# EAGLE design nano_shield (EAGLE 8.2.2)
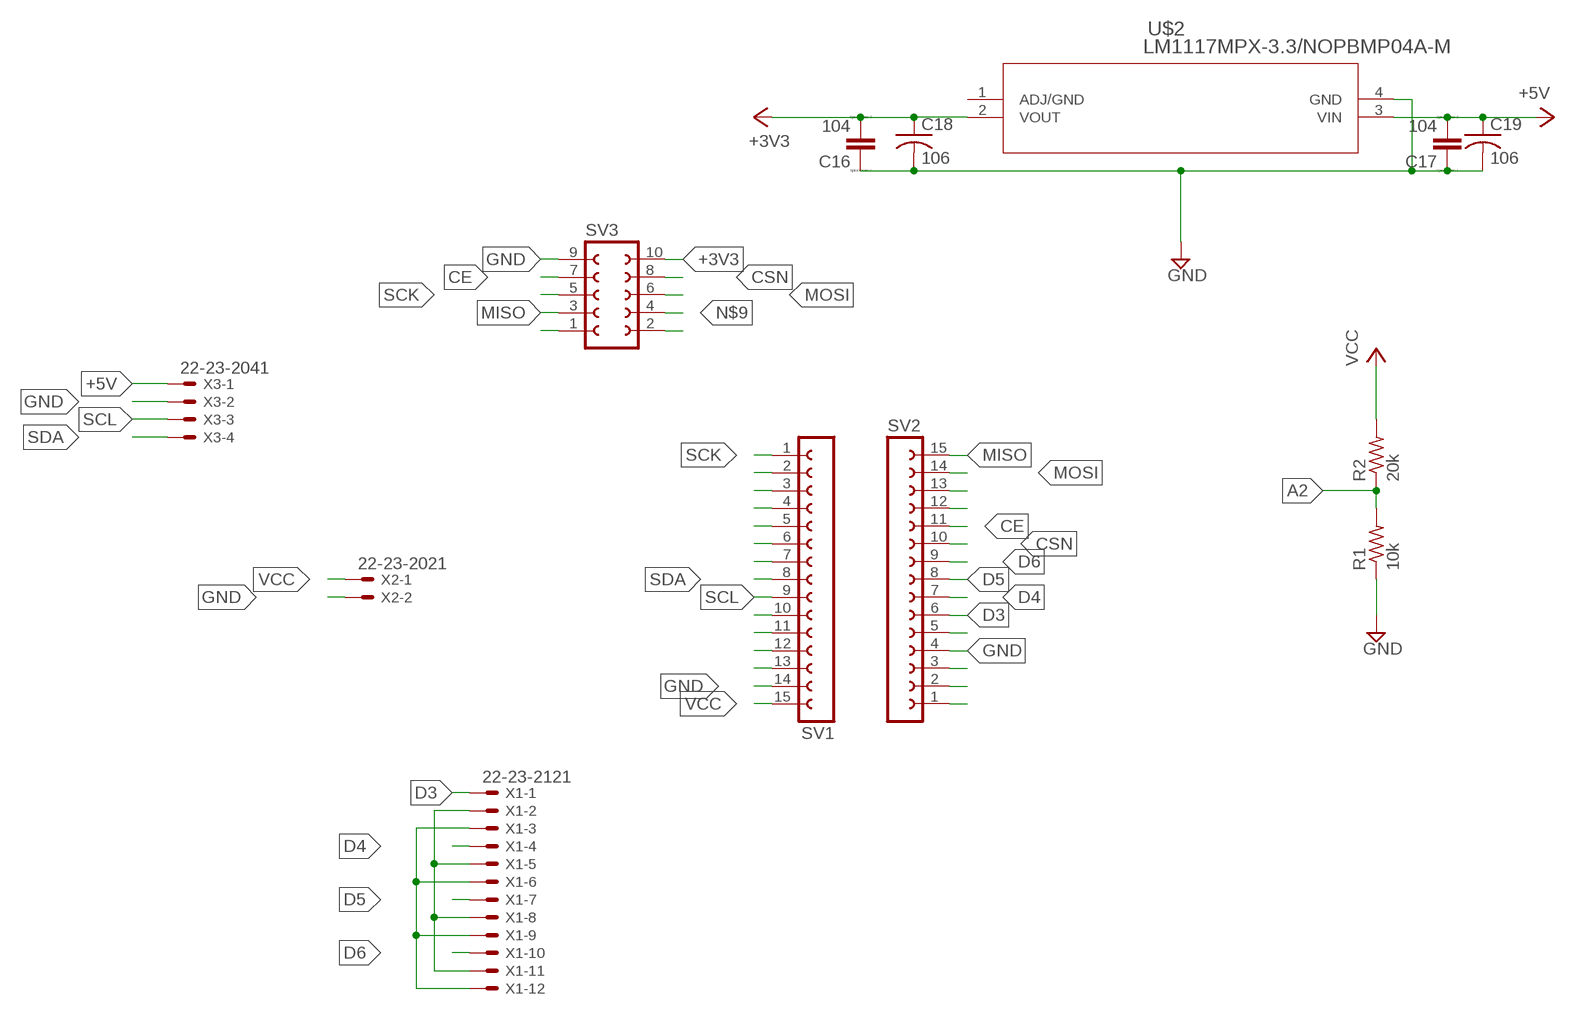
[diagram p0: schematic, sheet 1]

## Parts
C16  104  CC0603  [C0603]
C17  104  CC0603  [C0603]
C18  106  C-USC0805  [C0805]
C19  106  C-USC0805  [C0805]
R1  10k  R-US_R0603  [R0603]
R2  20k  R-US_R0603  [R0603]
SV1  FE15-1  [FE15]
SV2  FE15-1  [FE15]
SV3  FE05-2  [FE05-2]
U$2  LM1117MPX-3.3/NOPBMP04A-M  [MP04A-M]
X1  22-23-2121  [22-23-2121]
X2  22-23-2021  [22-23-2021]
X3  22-23-2041  [22-23-2041]

## Nets
+3V3: C16.2 C18.1 SV3.10 U$2.2(VOUT)
+5V: C17.2 C19.1 U$2.3(VIN) X1.2 X1.5 X1.8 X1.11 X3.1
A2: R1.2 R2.1 SV1.6
CE: SV2.11 SV3.7
CSN: SV2.10 SV3.8
D3: SV2.6 X1.1
D4: SV2.7 X1.4
D5: SV2.8 X1.7
D6: SV2.9 X1.10
GND: C16.1 C17.1 C18.2 C19.2 R1.1 SV1.14 SV2.4 SV3.9 U$2.4(GND) X1.3 X1.6 X1.9 X1.12 X2.2 X3.2
MISO: SV2.15 SV3.3
MOSI: SV2.14 SV3.6
N$5: SV3.1
N$6: SV1.2
N$9: SV3.4
N$10: SV3.2
N$11: SV1.3
N$12: SV1.4
N$13: SV1.5
N$15: SV1.7
N$18: SV1.10
N$19: SV1.11
N$20: SV1.12
N$21: SV1.13
N$26: SV2.13
N$27: SV2.12
N$34: SV2.5
N$36: SV2.3
N$37: SV2.2
N$38: SV2.1
SCK: SV1.1 SV3.5
SCL: SV1.9 X3.3
SDA: SV1.8 X3.4
VCC: R2.2 SV1.15 X2.1
Unconnected: U$2.1(ADJ/GND)

## Library data of the parts
C16 C17 = eagle-ltspice:C: CAPACITOR, European symbol; SPICEMODEL: NONE; SPICEPREFIX: C
C18 C19 = rcl:C-US: CAPACITOR, American symbol
R1 R2 = rcl:R-US_: RESISTOR, American symbol
SV1 SV2 = con-lsta:FE15-1: FEMALE HEADER; OC_FARNELL: unknown; OC_NEWARK: unknown
SV3 = con-lsta:FE05-2: FEMALE HEADER; OC_FARNELL: unknown; OC_NEWARK: unknown
U$2 = lm1117:LM1117MPX-3.3/NOPB; MANUFACTURER_PART_NUMBER: LM1117MPX3.3NOPB; VENDOR: National Semiconductor
X1 = con-molex:22-23-2121: .100" (2.54mm) Center Header - 12 Pin; MF: MOLEX; MPN: 22-23-2121; OC_FARNELL: 1462935; OC_NEWARK: 56H0456
X2 = con-molex:22-23-2021: .100" (2.54mm) Center Header - 2 Pin; MF: MOLEX; MPN: 22-23-2021; OC_FARNELL: 1462926; OC_NEWARK: 25C3832
X3 = con-molex:22-23-2041: .100" (2.54mm) Center Header - 4 Pin; MF: MOLEX; MPN: 22-23-2041; OC_FARNELL: 1462920; OC_NEWARK: 38C0355

## Net classes
0 default: width 0.305 mm, drill 0.508 mm, clearance 0.254 mm

## Board
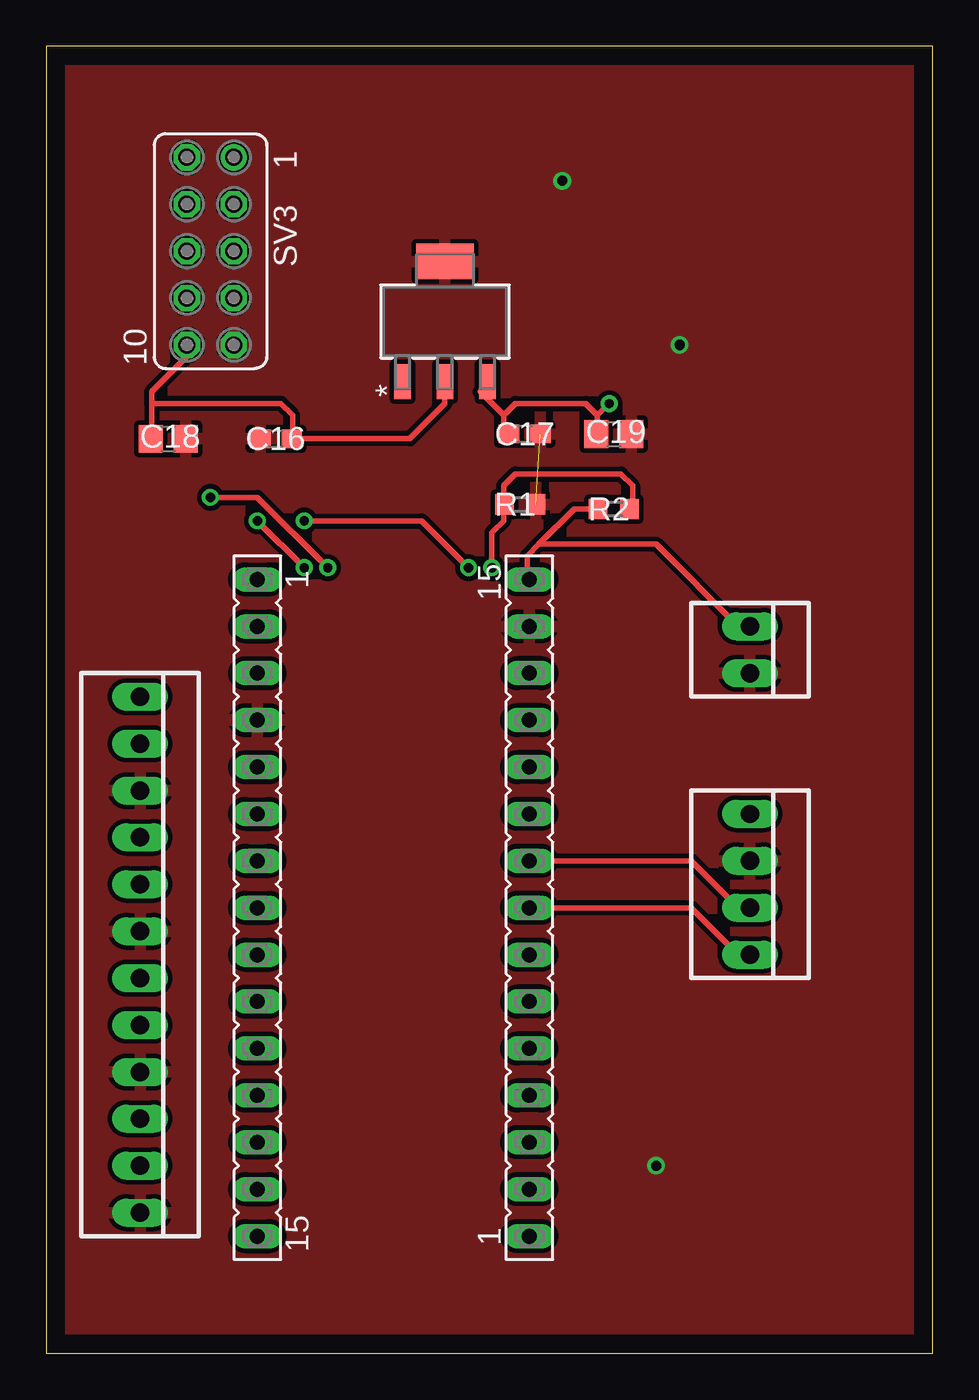
[diagram p1: board, top side]
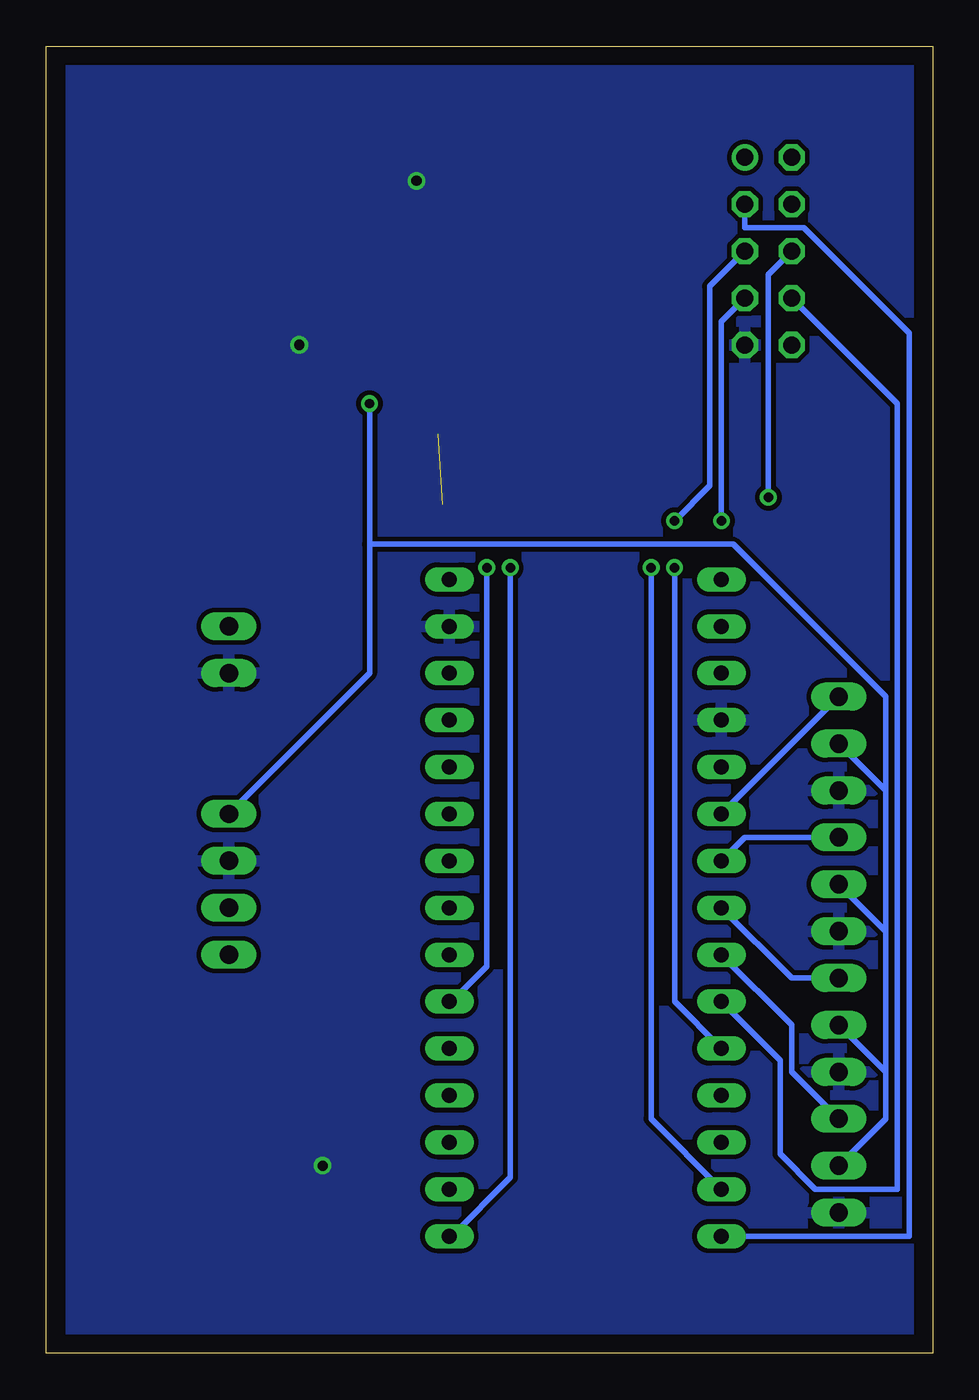
[diagram p2: board, bottom side, seen from below]

Size 47.99 x 70.79 mm. Coordinates in mm from the lower left corner, seen from the top.
Outline: 0,0 47.99,0 47.99,70.79 0,70.79 0,0
Copper layers (1*16): Top 0.035mm / dielectric 1.5mm / Bottom 0.035mm
Design rules "default": minimum track width 6mil, minimum drill 0.35mm, track to track 6mil, track to pad 6mil, pad to pad 6mil, via to via 6mil, smd to smd 6mil, copper to edge 40mil, drill to drill 6mil, minimum pad ring 10mil, minimum via ring 8mil, stop-mask expansion 4mil, vias tented up to drill 0mil, thermal gap 10mil

### Footprints (pad centres in the part's own frame; a part is rotated, then mirrored left to right if it is on the bottom)
C0603 = smd 1.1 x 1: 1 -0.85,0; 2 0.85,0
C0805 = smd 1.3 x 1.5: 1 -0.95,0; 2 0.95,0
R0603 = smd 1 x 1.1: 1 -0.85,0; 2 0.85,0
FE15 = drill 0.813 long: 1 -17.78,0; 2 -15.24,0; 3 -12.7,0; 4 -10.16,0; 5 -7.62,0; 6 -5.08,0; 7 -2.54,0; 8 0,0; 9 2.54,0; 10 5.08,0; 11 7.62,0; 12 10.16,0; 13 12.7,0; 14 15.24,0; 15 17.78,0
FE05-2 = drill 0.914: 1 -5.08,1.27 | drill 0.914 octagon: 2 -5.08,-1.27; 3 -2.54,1.27; 4 -2.54,-1.27; 5 0,1.27; 6 0,-1.27; 7 2.54,1.27; 8 2.54,-1.27; 9 5.08,1.27; 10 5.08,-1.27
MP04A-M = smd 1.905 x 0.889: 1 -3.251,2.3; 2 -3.251,0; 3 -3.251,-2.3 | smd 1.905 x 3.099: 4 3.251,0
22-23-2121 = drill 1 long: 1 -13.97,0; 2 -11.43,0; 3 -8.89,0; 4 -6.35,0; 5 -3.81,0; 6 -1.27,0; 7 1.27,0; 8 3.81,0; 9 6.35,0; 10 8.89,0; 11 11.43,0; 12 13.97,0
22-23-2021 = drill 1 long: 1 -1.27,0; 2 1.27,0
22-23-2041 = drill 1 long: 1 -3.81,0; 2 -1.27,0; 3 1.27,0; 4 3.81,0

### Placement (x,y rotation side)
C16  12.45,49.53 0 top
C17  25.91,49.78 180 top
C18  6.6,49.53 0 top
C19  30.73,49.78 0 top
R1  25.65,45.97 180 top
R2  30.73,45.72 180 top
SV1  26.16,24.13 90 top
SV2  11.43,24.13 270 top
SV3  8.89,59.69 270 top
U$2  21.59,55.88 90 top
X1  5.08,21.59 270 top
X2  38.1,38.1 270 top
X3  38.1,25.4 270 top

### Tracks (layer width: path | path; a pad name or v marks a point on that pad's centre or on a via)
+3V3
  Top 0.305: 5.71,51.44 5.71,52.07 7.62,53.98 SV3.10 | 5.71,51.44 5.71,49.53 C18.1 | 13.34,49.53 19.68,49.53 21.59,51.44 U$2.2 | 5.71,51.44 12.7,51.44 13.34,50.8 13.34,49.53 | 13.34,49.53 C16.2
+5V  (via drill 0.51)
  Top 0.305: 24.77,50.8 24.77,50.17 C17.2 | 24.77,50.8 23.5,52.07 U$2.3 | 29.84,50.8 29.84,50.17 C19.1 | 29.84,50.8 29.21,51.44 25.4,51.44 24.77,50.8 | 29.84,50.8 v30.48,51.44
  Bottom 0.305: X1.11 2.54,12.7 2.54,15.24 | X1.8 2.54,15.24 | 2.54,22.86 X1.5 | 2.54,15.24 2.54,22.86 | 2.54,30.48 X1.2 | 2.54,22.86 2.54,30.48 | X3.1 30.48,36.83 30.48,43.82 | v30.48,51.44 30.48,43.82 | 2.54,30.48 2.54,35.56 10.79,43.82 30.48,43.82
A2  (via drill 0.51)
  Top 0.305: R2.1 31.75,45.72 31.75,46.99 31.11,47.62 25.4,47.62 24.77,46.99 24.77,46.36 R1.2 24.77,45.72 24.77,45.09 24.13,44.45 v24.13,42.55
  Bottom 0.305: v24.13,42.55 24.13,20.95 26.04,19.05 SV1.6
CE  (via drill 0.51)
  Top 0.305: v11.43,45.09 v13.97,42.55
  Bottom 0.305: SV2.11 13.97,19.05 v13.97,42.55 | v11.43,45.09 11.43,55.88 SV3.7
CSN
  Bottom 0.305: SV2.10 8.26,15.88 8.26,10.79 6.35,8.89 1.91,8.89 1.91,51.44 SV3.8
D3
  Bottom 0.305: X1.1 SV2.6
D4
  Bottom 0.305: SV2.7 10.16,27.94 X1.4
D5
  Bottom 0.305: SV2.8 7.62,20.32 X1.7
D6
  Bottom 0.305: SV2.9 7.62,17.78 7.62,15.24 X1.10
GND  (via drill 0.55)  (1 unrouted)
  other vias: 27.94,63.5 34.29,54.61 33.02,10.16
  pour Top: 0.73,0.5 47.03,0.5 47.03,70.39 0.73,70.39
  pour Bottom: 0.73,70.39 47.03,70.39 47.03,0.73 0.73,0.73
MISO
  Bottom 0.305: SV2.15 1.27,6.35 1.27,55.25 6.99,60.96 10.16,60.96 SV3.3
MOSI  (via drill 0.51)
  Top 0.305: v15.24,42.55 11.43,46.36 v8.89,46.36
  Bottom 0.305: SV2.14 15.24,12.7 v15.24,42.55 | v8.89,46.36 8.89,58.42 SV3.6
SCK  (via drill 0.51)
  Top 0.305: v22.86,42.55 20.32,45.09 v13.97,45.09
  Bottom 0.305: v22.86,42.55 22.86,9.53 26.04,6.35 SV1.1 | v13.97,45.09 12.06,46.99 12.06,57.79 SV3.5
SCL
  Top 0.305: SV1.9 34.92,26.67 37.47,24.13 X3.3
SDA
  Top 0.305: SV1.8 34.92,24.13 37.47,21.59 X3.4
VCC
  Top 0.305: R2.2 28.57,45.72 26.67,43.82 | 26.67,43.82 26.04,43.18 26.04,41.91 SV1.15 | X2.1 37.47,39.37 33.02,43.82 26.67,43.82